# Altium project Filter.PrjPcb
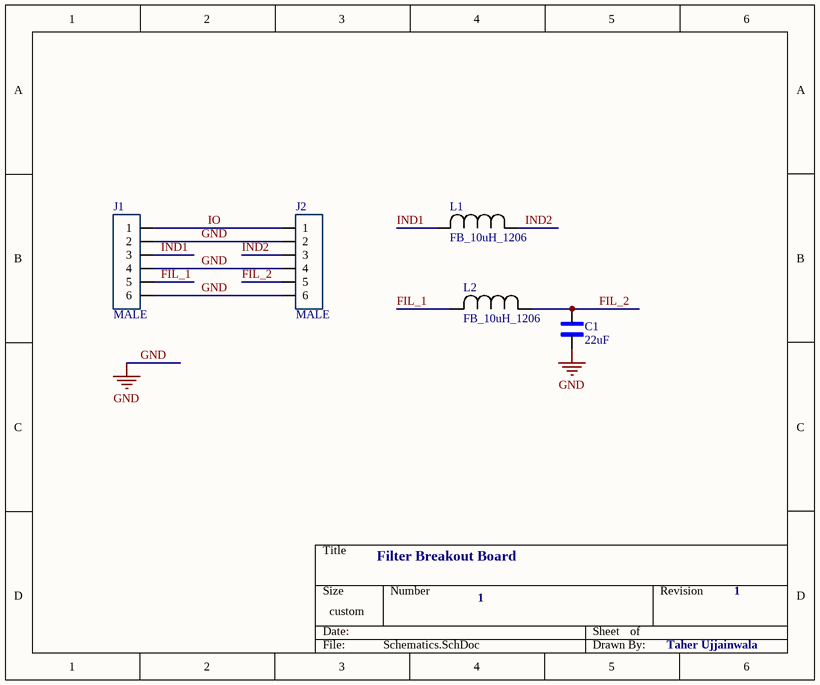
[diagram p0: Schematics.SchDoc]
1 sheet, 5 parts. Net scope: global (net labels, ports and power ports of the same name join across sheets).
Board file: Filter_Layout.PcbDoc

## Sheet Schematics.SchDoc
size 152 x 127 mm; SheetNumber: 1; SheetTotal: 1

### Parts
C1  22uF  [1206_Passive_Capacitor]
J1  MALE  [6_PIN_100MIL-Male]
J2  MALE  [6_PIN_100MIL-Male]
L1  FB_10uH_1206  [AIML-1206_ABR-M]
L2  FB_10uH_1206  [AIML-1206_ABR-M]

### Nets
GND: C1.1 J1.2 J1.4 J1.6 J2.2 J2.4 J2.6
FIL_1: J1.5 L2.2
FIL_2: C1.2 J2.5 L2.1
IND1: J1.3 L1.2
IND2: J2.3 L1.1
IO: J1.1 J2.1

### Notes on the sheet
- Filter Breakout Board
- 1
- Taher Ujjainwala

### Library data of the parts
C1 = C_22uF_1206: 22uF ±10% 25V X5R 1206 Multilayer Ceramic Capacitors MLCC - SMD/SMT RoHS; MFR Part #: CL31A226KAHNNNE; Type: basic; LCSC Part#: C12891; Datasheet: https://datasheet.lcsc.com/lcsc/1811031514_Samsung-Electro-Mechanics-CL31A226KAHNNNE_C12891.pdf; Value: 22uF
J1 J2 = JM_6_PIN_MALE: Male header- 6 pin 1 row- through Hole; LCSC Part#: C37208; Datasheet: https://datasheet.lcsc.com/szlcsc/1810312320_BOOMELE-Boom-Precision-Elec-C37208_C37208.pdf; Type: Extended; Value: MALE
L1 L2 = FB_10uH_1206: 25mA 10uH ±10% 800mΩ 1206  Inductors (SMD) ROHS; Mfr_Name: FH (Guangdong Fenghua Advanced Tech); MFR PART #: CMI321609X100KT; Type: Basic; LCSC PART#: C1051; DataSheet: https://datasheet.lcsc.com/lcsc/1810311314_FH--Guangdong-Fenghua-Advanced-Tech-CMI321609X100KT_C1051.pdf